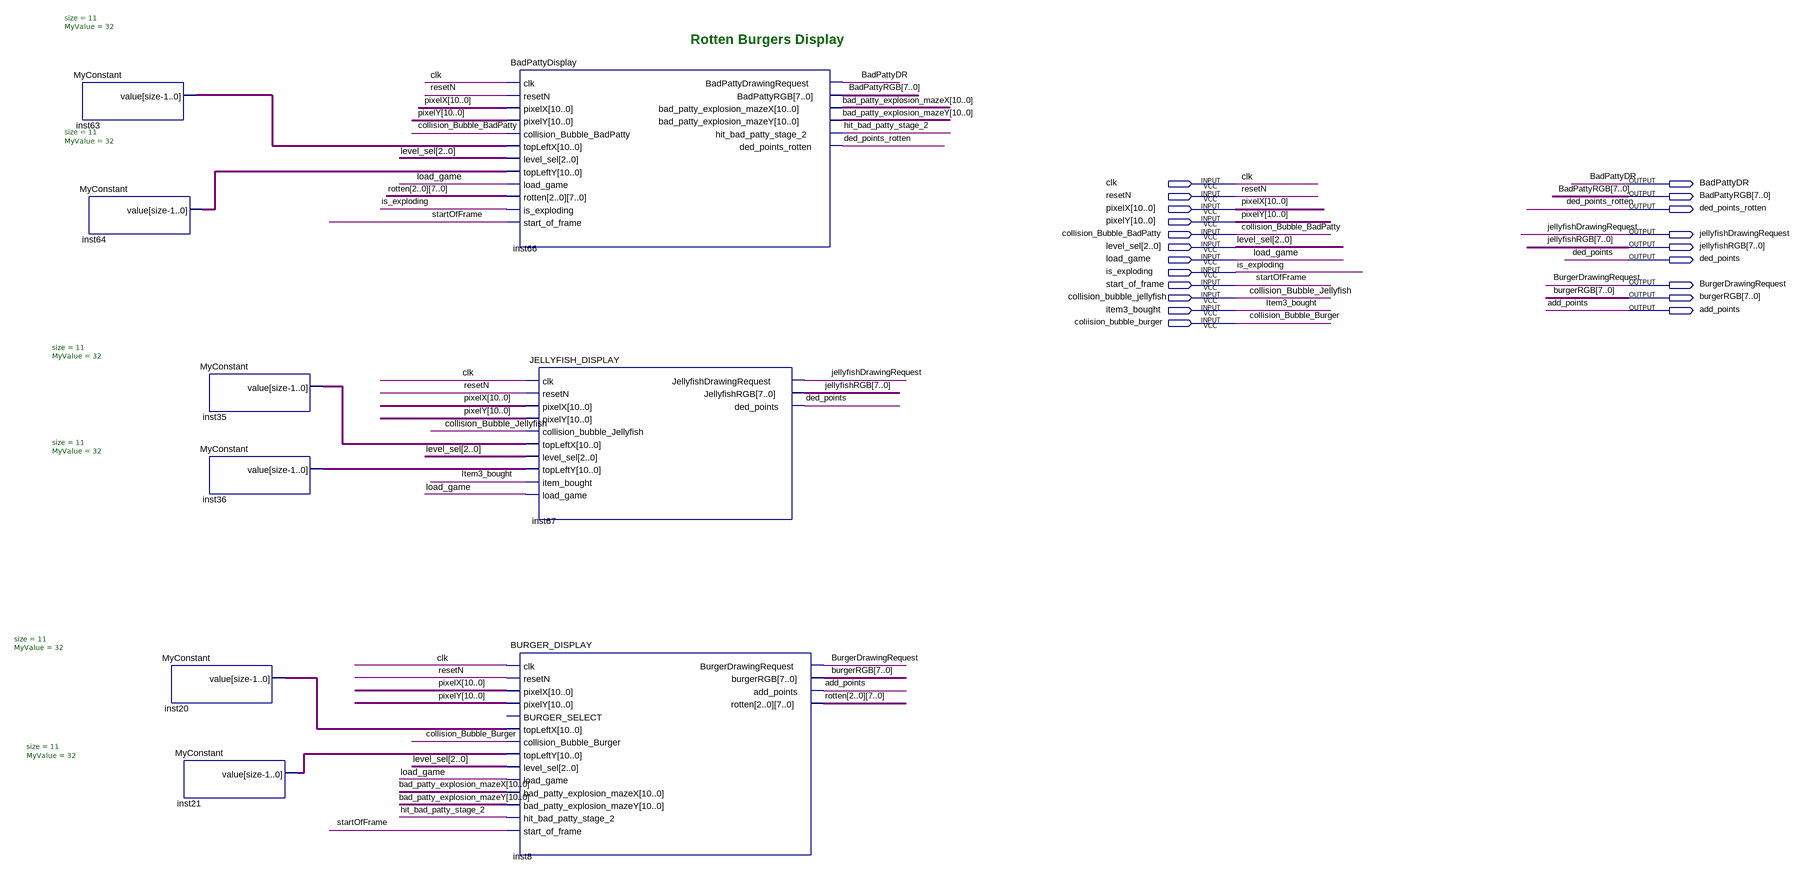
[diagram p0: schematic sheet]
// Quartus schematic game_objects.bdf as structural Verilog: 9 symbols, 21 pins
module game_objects (
  input  clk,
  input  resetN,
  input  [10:0] pixelX,
  input  [10:0] pixelY,
  input  collision_Bubble_BadPatty,
  input  [2:0] level_sel,
  input  load_game,
  input  is_exploding,
  input  start_of_frame,
  input  collision_bubble_jellyfish,
  input  item3_bought,
  input  coliision_bubble_burger,
  output BadPattyDR,
  output [7:0] BadPattyRGB,
  output ded_points_rotten,
  output jellyfishDrawingRequest,
  output [7:0] jellyfishRGB,
  output ded_points,
  output BurgerDrawingRequest,
  output [7:0] burgerRGB,
  output add_points
);

  wire hit_bad_patty_stage_2;
  wire [7:0] rotten_0, rotten_1, rotten_2;
  wire [10:0] bad_patty_explosion_mazeX, bad_patty_explosion_mazeY, inst20_value, inst21_value, inst35_value,
       inst36_value, inst63_value, inst64_value;

  MyConstant #(.size(11), .MyValue(32)) inst63 (.value(inst63_value));
  MyConstant #(.size(11), .MyValue(32)) inst64 (.value(inst64_value));
  MyConstant #(.size(11), .MyValue(32)) inst20 (.value(inst20_value));
  MyConstant #(.size(11), .MyValue(32)) inst21 (.value(inst21_value));
  MyConstant #(.size(11), .MyValue(32)) inst35 (.value(inst35_value));
  MyConstant #(.size(11), .MyValue(32)) inst36 (.value(inst36_value));
  BadPattyDisplay inst66 (
    .clk(clk), .resetN(resetN), .pixelX(pixelX), .pixelY(pixelY),
    .collision_Bubble_BadPatty(collision_Bubble_BadPatty), .topLeftX(inst63_value), .level_sel(level_sel),
    .topLeftY(inst64_value), .load_game(load_game), .rotten({rotten_2, rotten_1, rotten_0}),
    .is_exploding(is_exploding), .start_of_frame(start_of_frame), .BadPattyDrawingRequest(BadPattyDR),
    .BadPattyRGB(BadPattyRGB), .bad_patty_explosion_mazeX(bad_patty_explosion_mazeX),
    .bad_patty_explosion_mazeY(bad_patty_explosion_mazeY), .hit_bad_patty_stage_2(hit_bad_patty_stage_2),
    .ded_points_rotten(ded_points_rotten));
  JELLYFISH_DISPLAY inst67 (
    .clk(clk), .resetN(resetN), .pixelX(pixelX), .pixelY(pixelY),
    .collision_bubble_Jellyfish(collision_bubble_jellyfish), .topLeftX(inst35_value), .level_sel(level_sel),
    .topLeftY(inst36_value), .item_bought(item3_bought), .load_game(load_game),
    .JellyfishDrawingRequest(jellyfishDrawingRequest), .JellyfishRGB(jellyfishRGB), .ded_points(ded_points));
  BURGER_DISPLAY inst8 (
    .clk(clk), .resetN(resetN), .pixelX(pixelX), .pixelY(pixelY), .topLeftX(inst20_value),
    .collision_Bubble_Burger(coliision_bubble_burger), .topLeftY(inst21_value), .level_sel(level_sel),
    .load_game(load_game), .bad_patty_explosion_mazeX(bad_patty_explosion_mazeX),
    .bad_patty_explosion_mazeY(bad_patty_explosion_mazeY), .hit_bad_patty_stage_2(hit_bad_patty_stage_2),
    .start_of_frame(start_of_frame), .BurgerDrawingRequest(BurgerDrawingRequest), .burgerRGB(burgerRGB),
    .add_points(add_points), .rotten({rotten_2, rotten_1, rotten_0}));  // open: BURGER_SELECT

  // Other names for the same wires on the sheet: collision_Bubble_Burger = coliision_bubble_burger;
  //   startOfFrame = start_of_frame

  // Notes on the sheet:
  //   Rotten Burgers Display
endmodule
